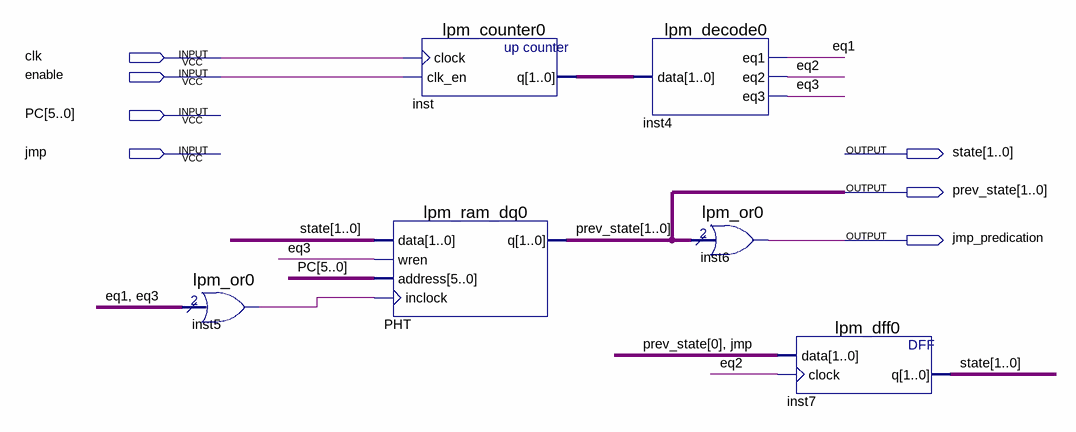
[diagram p0: schematic sheet]
// Quartus schematic lab_8.bdf as structural Verilog: 6 symbols, 7 pins
module lab_8 (
  input  clk,
  input  enable,
  input  [5:0] PC,
  input  jmp,
  output [1:0] state,
  output [1:0] prev_state,
  output jmp_predication
);

  wire eq1, eq2, eq3, inst5_result;
  wire [1:0] inst_q;

  lpm_or0 inst5 (.data({eq1, eq3}), .result(inst5_result));
  lpm_counter0 inst (.clock(clk), .clk_en(enable), .q(inst_q));
  lpm_ram_dq0 PHT (.data(state), .wren(eq3), .address(PC), .inclock(inst5_result), .q(prev_state));
  lpm_decode0 inst4 (.data(inst_q), .eq1(eq1), .eq2(eq2), .eq3(eq3));
  lpm_or0 inst6 (.data(prev_state), .result(jmp_predication));
  lpm_dff0 inst7 (.data({prev_state[0], jmp}), .clock(eq2), .q(state));
endmodule
